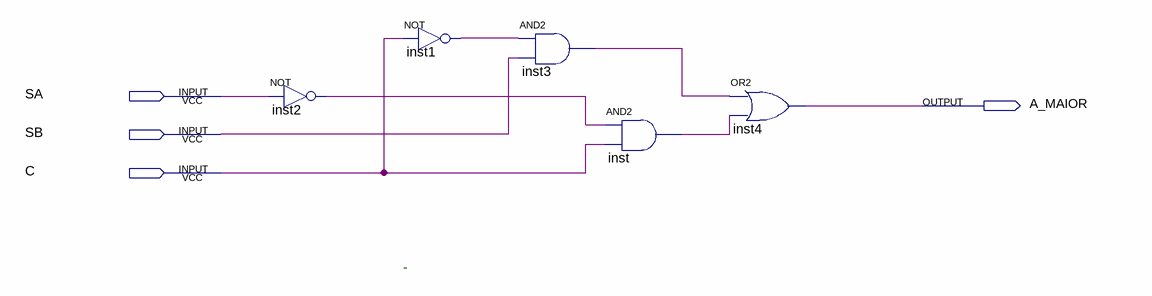
[diagram p0: schematic sheet]
// Quartus schematic COMPSINAL.bdf as structural Verilog: 5 symbols, 4 pins
module COMPSINAL (
  input  SA,
  input  SB,
  input  C,
  output A_MAIOR
);

  wire inst1_out, inst2_out, inst3_out, inst_out;

  not inst2 (inst2_out, SA);
  not inst1 (inst1_out, C);
  and inst3 (inst3_out, inst1_out, SB);
  and inst (inst_out, inst2_out, C);
  or inst4 (A_MAIOR, inst3_out, inst_out);

  // Notes on the sheet:
  //   -
endmodule
